# EAGLE design toes_V1 (EAGLE 9.5.2)
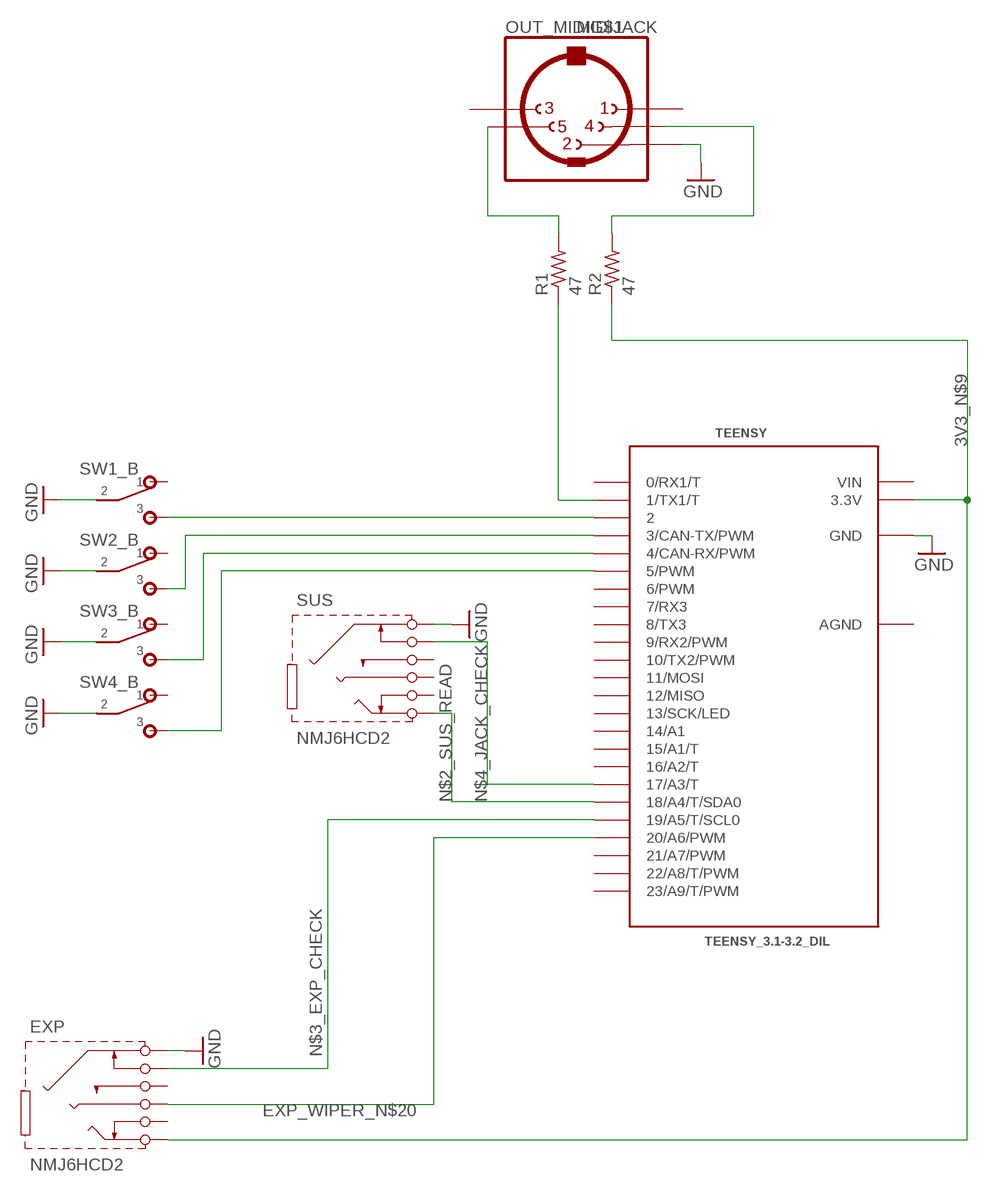
[diagram p0: schematic, sheet 1]

## Parts
EXP  NMJ6HCD2  [NMJ6HCD2]
OUT_MIDI  MIDIJACK  [CP-2350]
R1  47  R-US_0204/7  [0204/7]
R2  47  R-US_0204/7  [0204/7]
SUS  NMJ6HCD2  [NMJ6HCD2]
SW1  DPDTDPDT_MOM  [SF12011F-0202-20R-M-011]
SW2  DPDTDPDT_MOM  [SF12011F-0202-20R-M-011]
SW3  DPDTDPDT_MOM  [SF12011F-0202-20R-M-011]
SW4  DPDTDPDT_MOM  [SF12011F-0202-20R-M-011]
TEENSY  TEENSY_3.1-3.2_DIL  [TEENSY_3.0-3.2&LC_DIL]

## Nets
3V3_N$9: EXP.T(TIP) R2.1 TEENSY.3.3V
EXP_WIPER_N$20: EXP.R(RING) TEENSY.20/A6(20/A6/PWM)
GND: EXP.S(SLEEVE) OUT_MIDI.2 SUS.S(SLEEVE) SW1.P$5 SW2.P$5 SW3.P$5 SW4.P$5 TEENSY.GND
MIDI_OUT_N$8: R1.1 TEENSY.1(1/TX1/T)
N$2: OUT_MIDI.4 R2.2
N$2_SUS_READ: SUS.T(TIP) TEENSY.18/A4(18/A4/T/SDA0)
N$3: OUT_MIDI.5 R1.2
N$3_EXP_CHECK: EXP.SN(SLEEVE-S) TEENSY.19/A5(19/A5/T/SCL0)
N$4_JACK_CHECK: SUS.SN(SLEEVE-S) TEENSY.17/A3(17/A3/T)
SW1_N$14: SW1.P$6 TEENSY.2
SW2_N$15: SW2.P$6 TEENSY.3(3/CAN-TX/PWM)
SW3_N$16: SW3.P$6 TEENSY.4(4/CAN-RX/PWM)
SW4_N$17: SW4.P$6 TEENSY.5(5/PWM)
Unconnected: EXP.RN(RING-S) EXP.TN(TIP-S) OUT_MIDI.1 OUT_MIDI.3 OUT_MIDI.PE1(MT) OUT_MIDI.PE2(MT) OUT_MIDI.PE(MT) OUT_MIDI.PE@(MT) SUS.R(RING) SUS.RN(RING-S) SUS.TN(TIP-S) SW1.P$1 SW1.P$2 SW1.P$3 SW1.P$4 SW2.P$1 SW2.P$2 SW2.P$3 SW2.P$4 SW3.P$1 SW3.P$2 SW3.P$3 SW3.P$4 SW4.P$1 SW4.P$2 SW4.P$3 SW4.P$4 TEENSY.0(0/RX1/T) TEENSY.6(6/PWM) TEENSY.7(7/RX3) TEENSY.8(8/TX3) TEENSY.9(9/RX2/PWM) TEENSY.10(10/TX2/PWM) TEENSY.11(11/MOSI) TEENSY.12(12/MISO) TEENSY.13(13/SCK/LED) TEENSY.14/A0(14/A1) TEENSY.15/A1(15/A1/T) TEENSY.16/A2(16/A2/T) TEENSY.21/A7(21/A7/PWM) TEENSY.22/A8(22/A8/T/PWM) TEENSY.23/A9(23/A9/T/PWM)

## Power pins joined to a net without a drawn wire
AGND: TEENSY.AGND
VIN: TEENSY.VIN

## Library data of the parts
EXP SUS = NMJ6HCD2:NMJ6HCD2: M-Series 1/4" Mono Phone Connector; AVAILABILITY: Unavailable; DESCRIPTION: Jack 1/4 stereo switched - PCBH - supplied with chrome nose nut and NRJ-WB; MF: Neutrik; MP: NMJ6HCD2; PACKAGE: None; PRICE: None
OUT_MIDI = adafruit:MIDIJACK: DIN 5 jack also known as MIDI jack A modification of conn-hirshman:MAB5SH with two options for the grounding 'teeth'
R1 R2 = rcl:R-US_: RESISTOR, American symbol; SPICEPREFIX: R
SW1-SW4 = pedal_switches:DPDT
TEENSY = Teensy_3_and_LC_Series_Boards_v1.4:TEENSY_3.1-3.2_DIL: Teensy 3.1 or 3.2 in a DIL Layout.

## Board
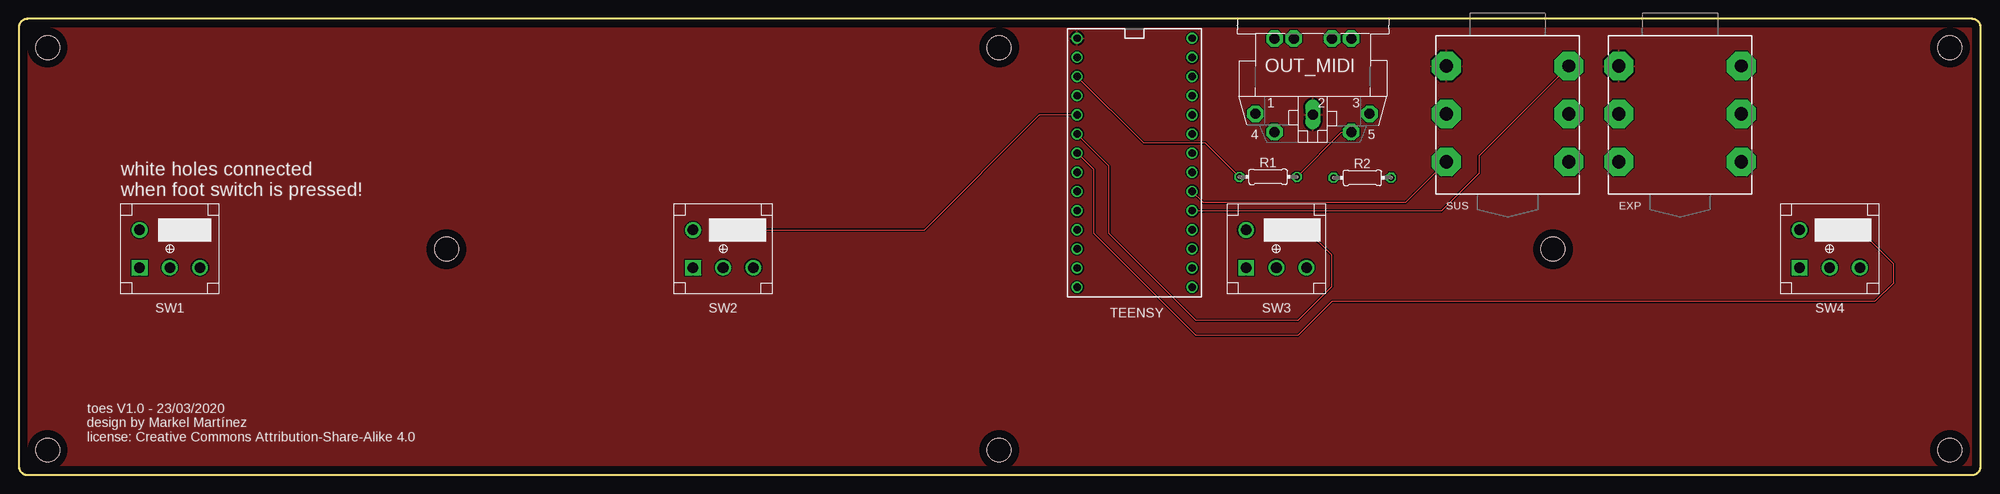
[diagram p1: board, top side]
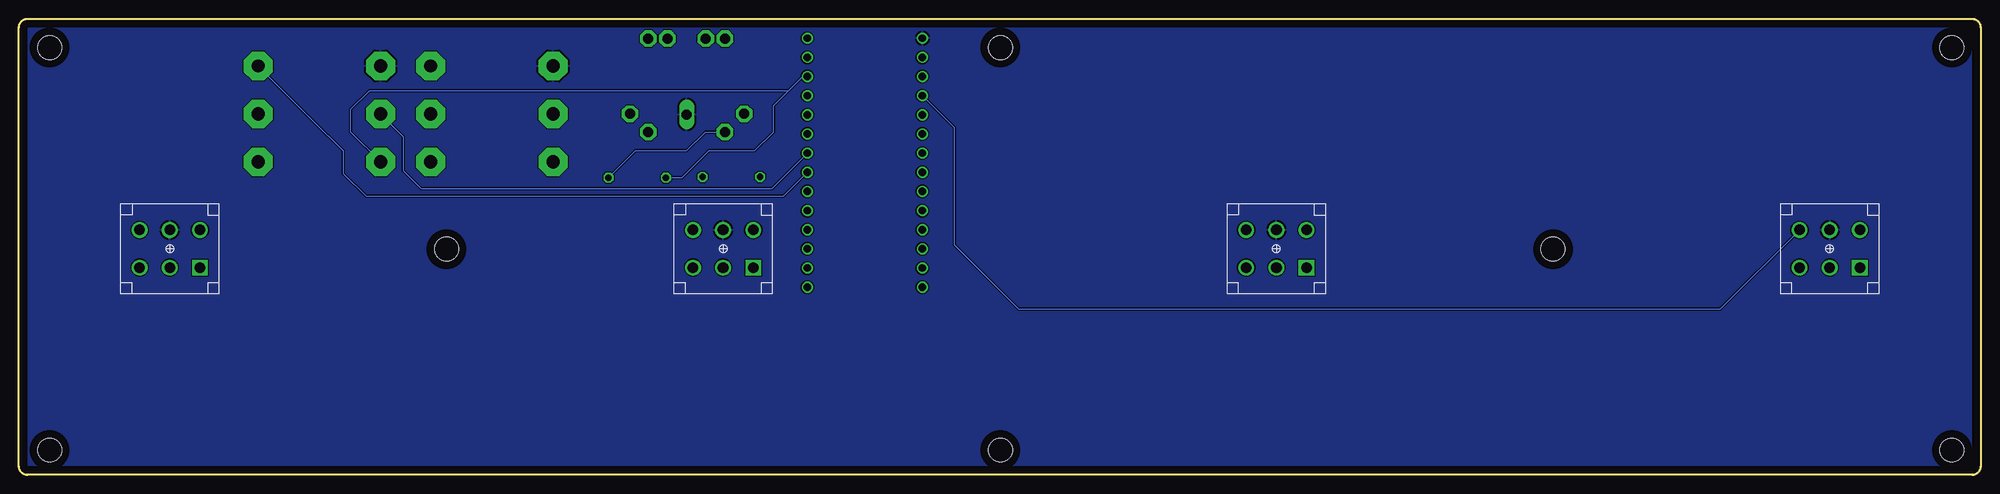
[diagram p2: board, bottom side, seen from below]

Size 260 x 60.5 mm. Coordinates in mm from the lower left corner, seen from the top.
Outline: 260,1.14 260,59.36 arc90 258.86,60.5 1.14,60.5 arc90 0,59.36 0,1.14 arc90 1.14,0 258.86,0 arc90 260,1.14
Copper layers (1*16): Top 0.035mm / dielectric 1.5mm / Bottom 0.035mm
Design rules "default": minimum track width 6mil, minimum drill 0.35mm, track to track 6mil, track to pad 6mil, pad to pad 6mil, via to via 6mil, smd to smd 6mil, copper to edge 40mil, drill to drill 6mil, minimum pad ring 10mil, minimum via ring 8mil, stop-mask expansion 4mil, vias tented up to drill 0mil, thermal gap 10mil
Holes 3.2 mm at 3.81,56.7 3.81,3.31 255.91,3.31 255.91,56.7 129.93,3.31 129.93,56.7 56.67,29.95 203.33,29.95

### Footprints (pad centres in the part's own frame; a part is rotated, then mirrored left to right if it is on the bottom)
NMJ6HCD2 = drill 1.778 pad 3.81 octagon: R -10.35,8.115; RN -10.35,-8.115; S -4,8.115; T -16.7,8.115; TN -16.7,-8.115 | drill 1.676 pad 3.81 octagon: SN -4,-8.115
CP-2350 = drill 1.321 pad 2.184 octagon: 1 7.62,12.58; 3 -7.52,12.58; 4 5.08,15.02; 5 -5.08,15.02; PE -2.54,2.62; PE1 -5.08,2.62; PE2 5.08,2.62; PE@ 2.54,2.62 | drill 1.321 long: 2 0,12.68
0204/7 = drill 0.813 octagon: 1 -3.81,0; 2 3.81,0
SF12011F-0202-20R-M-011 = drill 1.4 square: P$1 -2.5,4 | drill 1.4: P$2 -2.5,0; P$3 -2.5,-4; P$4 2.5,4; P$5 2.5,0; P$6 2.5,-4
TEENSY_3.0-3.2&LC_DIL = drill 0.965: 0 -7.62,13.97; 1 -7.62,11.43; 2 -7.62,8.89; 3 -7.62,6.35; 3.3V 7.62,11.43; 4 -7.62,3.81; 5 -7.62,1.27; 6 -7.62,-1.27; 7 -7.62,-3.81; 8 -7.62,-6.35; 9 -7.62,-8.89; 10 -7.62,-11.43; 11 -7.62,-13.97; 12 -7.62,-16.51; 13 7.62,-16.51; 14/A0 7.62,-13.97; 15/A1 7.62,-11.43; 16/A2 7.62,-8.89; 17/A3 7.62,-6.35; 18/A4 7.62,-3.81; 19/A5 7.62,-1.27; 20/A6 7.62,1.27; 21/A7 7.62,3.81; 22/A8 7.62,6.35; 23/A9 7.62,8.89; AGND 7.62,13.97; GND -7.62,16.51; VIN 7.62,16.51

### Placement (x,y rotation side)
EXP  220.17,58.24 90 top
OUT_MIDI  171.5,60.5 180 top
R1  165.56,39.54 0 top
R2  178.06,39.42 0 top
SUS  197.31,58.24 90 top
SW1  20,30 90 top
SW2  93.33,30 90 top
SW3  166.67,30 90 top
SW4  240,30 90 top
TEENSY  147.87,41.42 0 top

### Tracks (layer width: path | path; a pad name or v marks a point on that pad's centre or on a via)
3V3_N$9
  Bottom 0.152: EXP.T 216,45.48 216,48.5 213.5,51 162,51 161.84,51 158,51 | R2.1 172.08,39.42 168.5,43 162.5,43 160,45.5 160,49 158,51 | 158,51 156.15,52.85 TEENSY.3.3V
EXP_WIPER_N$20
  Bottom 0.152: EXP.R 209.06,44.89 209.06,40.39 206.66,38 160.18,38 TEENSY.20/A6
GND
  pour Top: 261.22,1.64 261.22,61.87 -1,61.87 -1,2.14 arc90 2.14,-1 258.58,-1 arc90
  pour Bottom: 261.22,61.87 -1,61.87 -1,2.14 arc90 2.14,-1 258.08,-1 arc90 261.22,2.14
MIDI_OUT_N$8
  Top 0.152: R1.1 157.29,44 149.1,44 TEENSY.1
N$2
  Bottom 0.152: R2.2 178.29,43 171.5,43 169,45.5 166.44,45.5 OUT_MIDI.4
N$2_SUS_READ
  Top 0.152: SUS.T 183.76,36.11 156.99,36.11 TEENSY.18/A4
N$3
  Top 0.152: R1.2 175.31,45.48 OUT_MIDI.5
N$3_EXP_CHECK
  Bottom 0.152: EXP.SN 219.04,45 219,45 217,43 217,40 214,37 158.64,37 TEENSY.19/A5
N$4_JACK_CHECK
  Top 0.152: SUS.SN 193.5,42.31 193.5,40 188.5,35 155.56,35 TEENSY.17/A3
SW1_N$14
  Bottom 0.152: SW1.P$6 34.5,22 127.5,22 136,30.5 136,46.06 TEENSY.2
SW2_N$15
  Top 0.152: SW2.P$6 120,32.5 135.27,47.77 TEENSY.3
SW3_N$16
  Top 0.152: SW3.P$6 174,29.17 174,25 169.5,20.5 156,20.5 144.5,32 144.5,40.98 TEENSY.4
SW4_N$17
  Top 0.152: SW4.P$6 248.5,28 248.5,25.5 246,23 174,23 169.5,18.5 156,18.5 142.5,32 142.5,40.5 140.31,42.69 TEENSY.5

### Text on the board
tNames: white holes connected / when foot switch is pressed! | toes V1.0 - 23/03/2020 / design by Markel Martínez / license: Creative Commons Attribution-Share-Alike 4.0